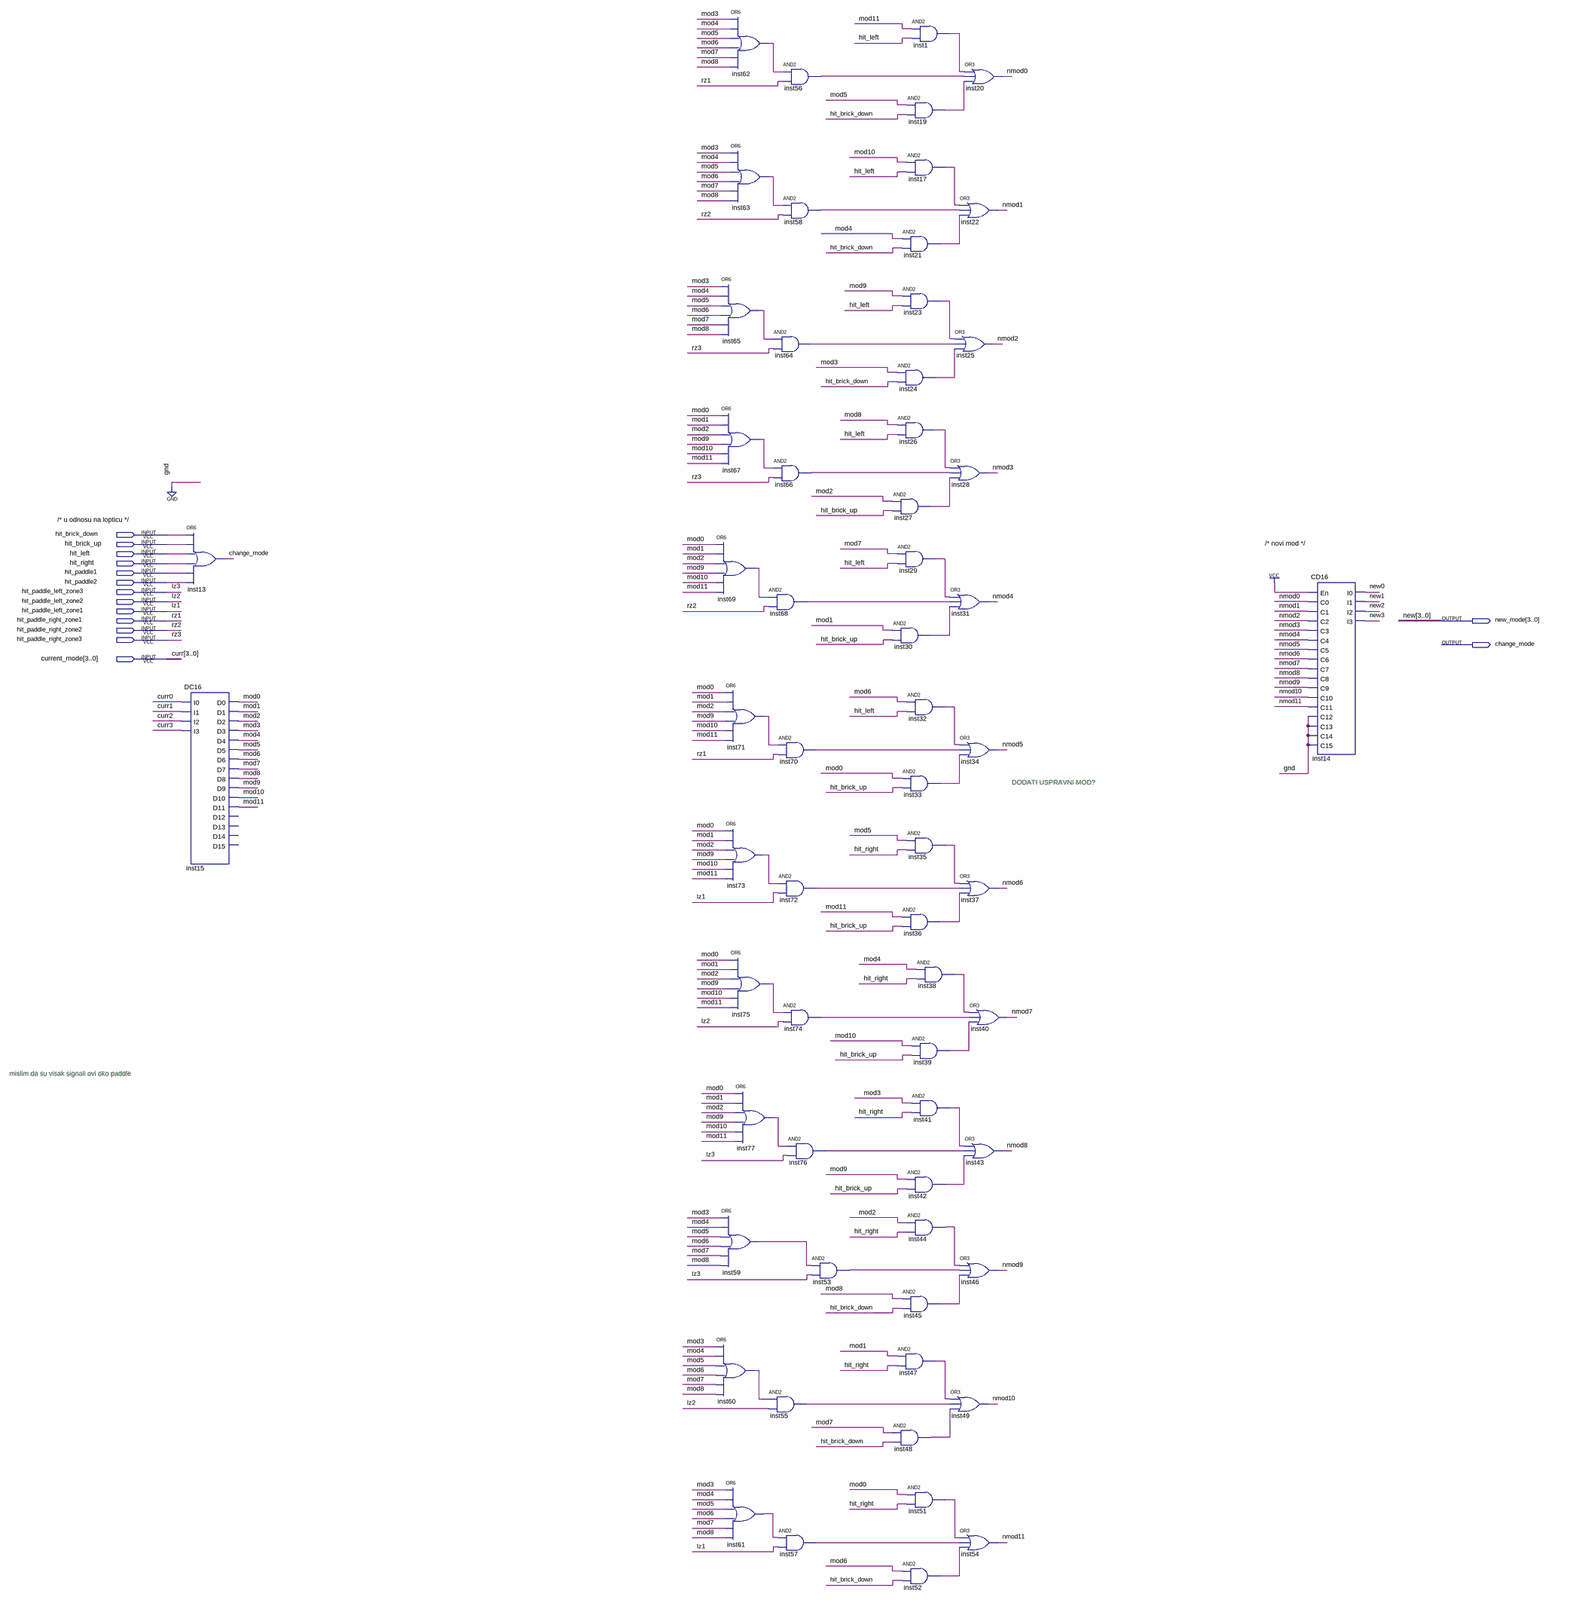
[diagram p0: schematic sheet, whole]
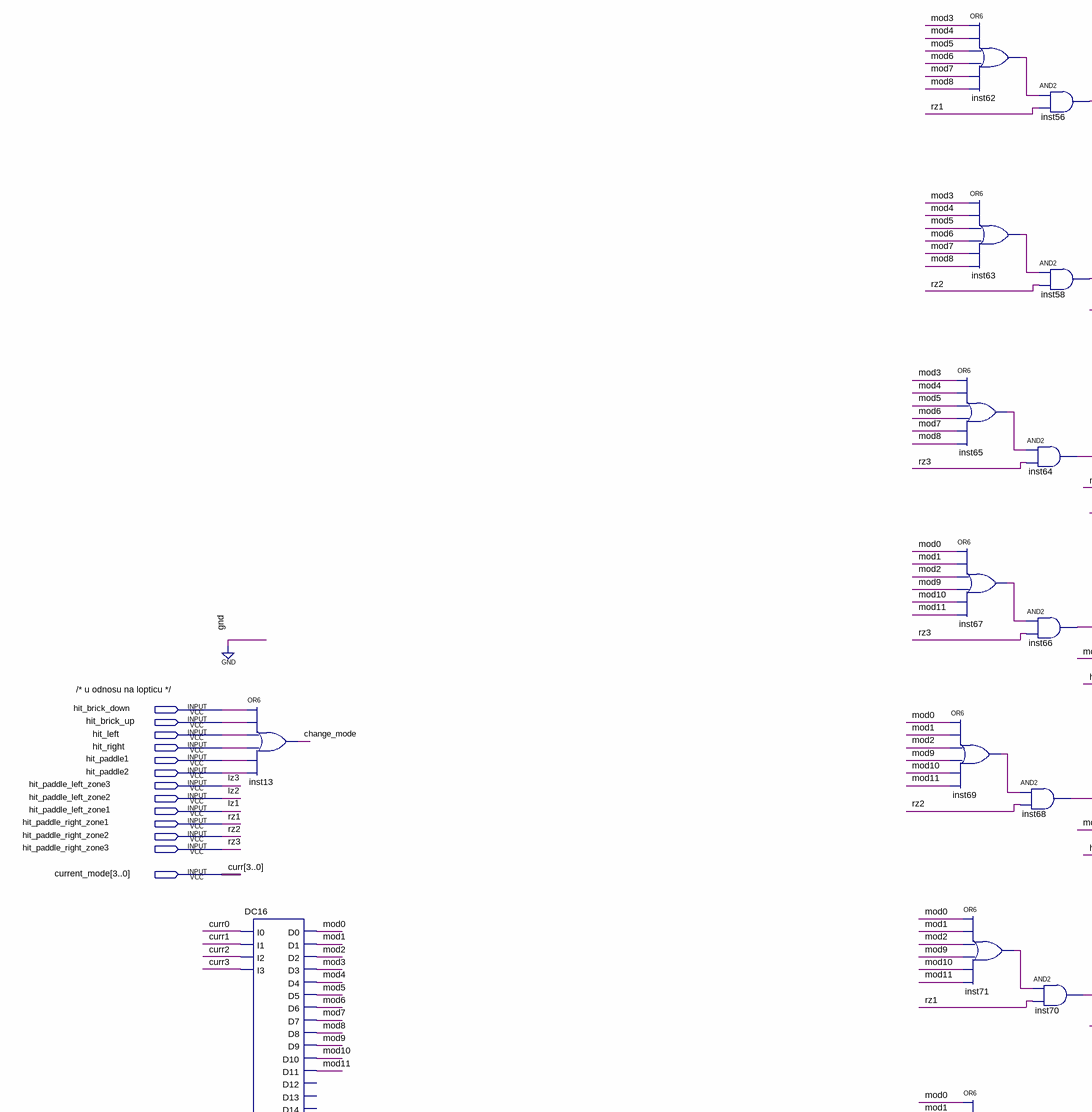
[diagram p1: schematic sheet, upper left part]
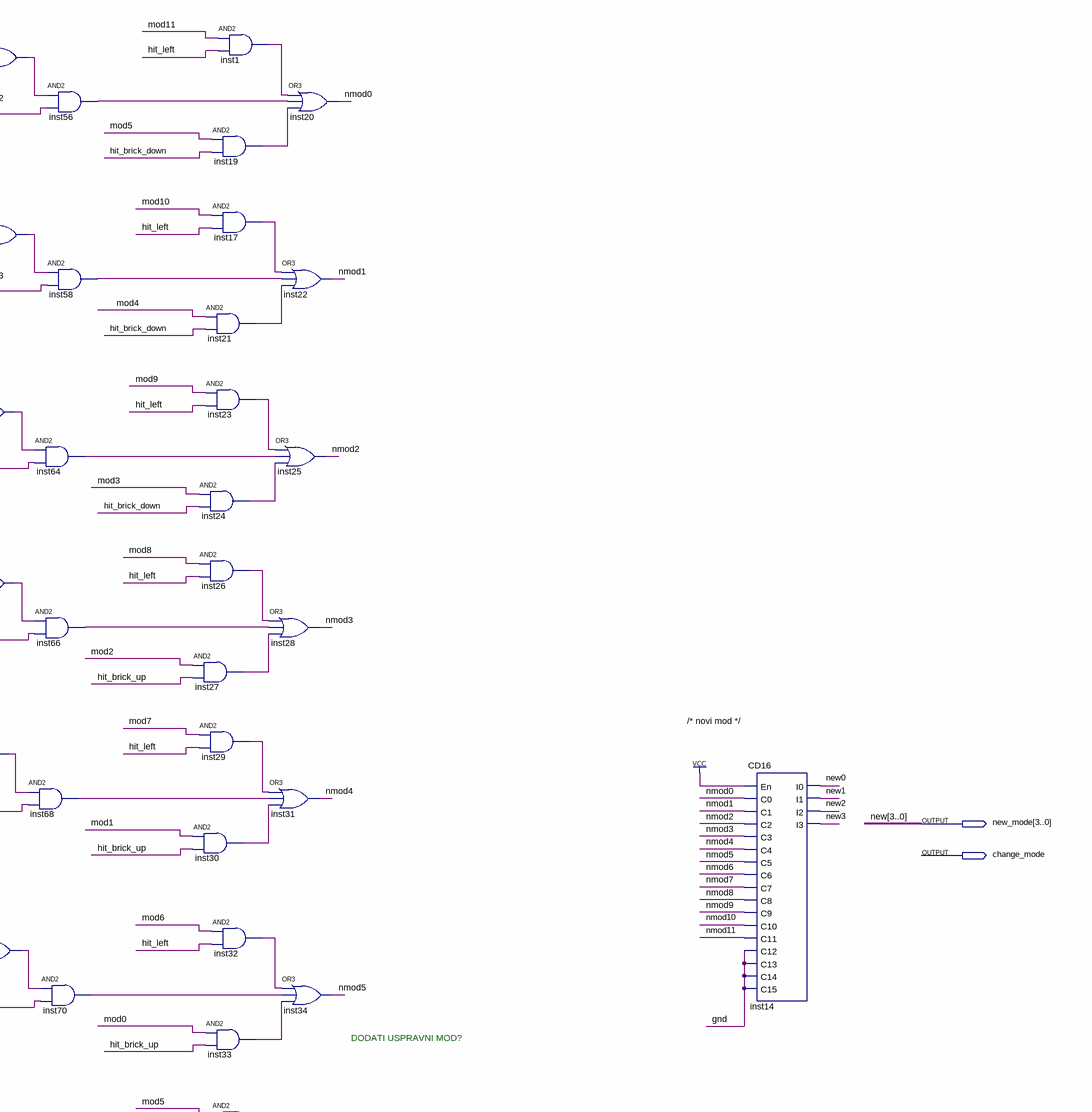
[diagram p2: schematic sheet, upper right part]
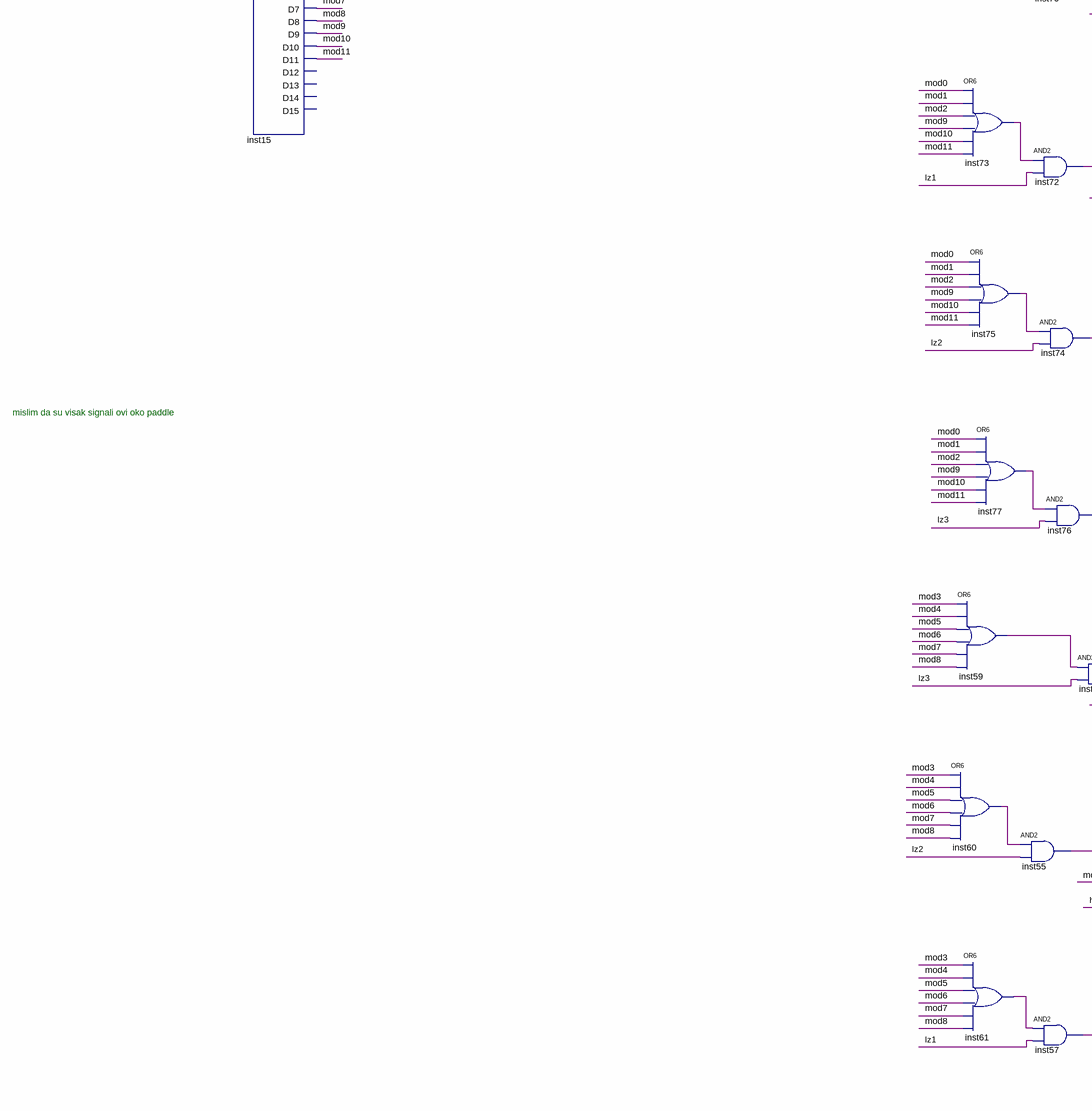
[diagram p3: schematic sheet, lower left part]
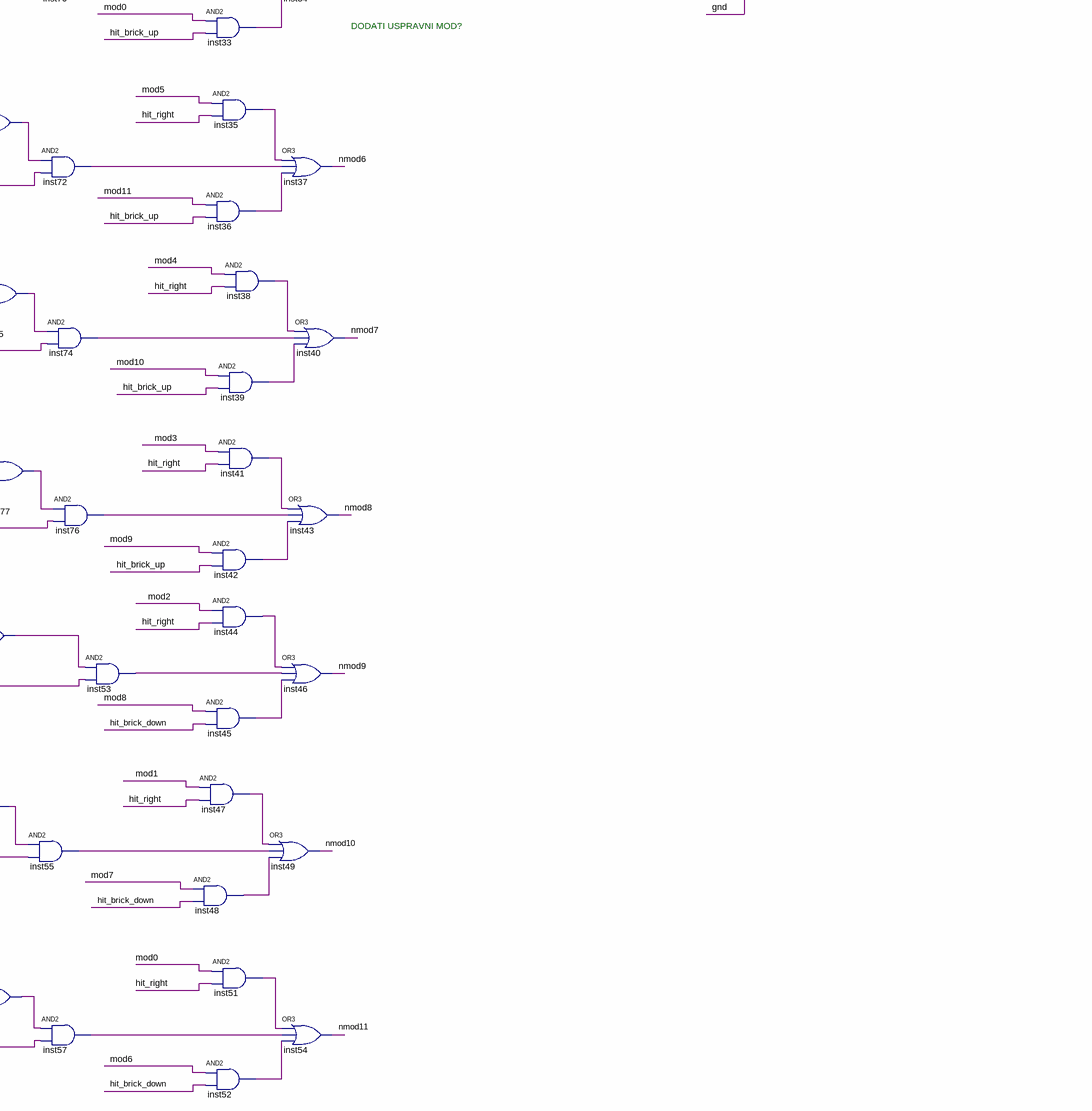
[diagram p4: schematic sheet, lower right part]
// Quartus schematic change_ball_movement.bdf as structural Verilog: 63 symbols, 15 pins
module change_ball_movement (
  input  hit_brick_down,
  input  hit_brick_up,
  input  hit_left,
  input  hit_right,
  input  hit_paddle1,
  input  hit_paddle2,
  input  hit_paddle_left_zone3,
  input  hit_paddle_left_zone2,
  input  hit_paddle_left_zone1,
  input  hit_paddle_right_zone1,
  input  hit_paddle_right_zone2,
  input  hit_paddle_right_zone3,
  input  [3:0] current_mode,
  output [3:0] new_mode,
  output change_mode
);

  wire inst1_out, inst17_out, inst19_out, inst21_out, inst23_out, inst24_out, inst26_out, inst27_out,
       inst29_out, inst30_out, inst32_out, inst33_out, inst35_out, inst36_out, inst38_out, inst39_out,
       inst41_out, inst42_out, inst44_out, inst45_out, inst47_out, inst48_out, inst51_out, inst52_out,
       inst53_out, inst55_out, inst56_out, inst57_out, inst58_out, inst59_out, inst60_out, inst61_out,
       inst62_out, inst63_out, inst64_out, inst65_out, inst66_out, inst67_out, inst68_out, inst69_out,
       inst70_out, inst71_out, inst72_out, inst73_out, inst74_out, inst75_out, inst76_out, inst77_out, mod0,
       mod1, mod2, mod3, mod4, mod5, mod6, mod7, mod8, mod9, mod10, mod11, nmod0, nmod1, nmod2, nmod3, nmod4,
       nmod5, nmod6, nmod7, nmod8, nmod9, nmod10, nmod11;

  or inst13 (change_mode, hit_brick_down, hit_brick_up, hit_left, hit_right, hit_paddle1, hit_paddle2);
  DC16 inst15 (
    .I0(current_mode[0]), .I1(current_mode[1]), .I2(current_mode[2]), .I3(current_mode[3]), .D0(mod0),
    .D1(mod1), .D2(mod2), .D3(mod3), .D4(mod4), .D5(mod5), .D6(mod6), .D7(mod7), .D8(mod8), .D9(mod9),
    .D10(mod10), .D11(mod11));  // open: D12, D13, D14, D15
  or inst62 (inst62_out, mod3, mod4, mod5, mod6, mod7, mod8);
  or inst63 (inst63_out, mod3, mod4, mod5, mod6, mod7, mod8);
  or inst65 (inst65_out, mod3, mod4, mod5, mod6, mod7, mod8);
  or inst67 (inst67_out, mod0, mod1, mod2, mod9, mod10, mod11);
  or inst69 (inst69_out, mod0, mod1, mod2, mod9, mod10, mod11);
  or inst71 (inst71_out, mod0, mod1, mod2, mod9, mod10, mod11);
  or inst73 (inst73_out, mod0, mod1, mod2, mod9, mod10, mod11);
  or inst75 (inst75_out, mod0, mod1, mod2, mod9, mod10, mod11);
  or inst77 (inst77_out, mod0, mod1, mod2, mod9, mod10, mod11);
  or inst59 (inst59_out, mod3, mod4, mod5, mod6, mod7, mod8);
  or inst60 (inst60_out, mod3, mod4, mod5, mod6, mod7, mod8);
  or inst61 (inst61_out, mod3, mod4, mod5, mod6, mod7, mod8);
  and inst64 (inst64_out, inst65_out, hit_paddle_right_zone3);
  and inst66 (inst66_out, inst67_out, hit_paddle_right_zone3);
  and inst68 (inst68_out, inst69_out, hit_paddle_right_zone2);
  and inst70 (inst70_out, inst71_out, hit_paddle_right_zone1);
  and inst72 (inst72_out, inst73_out, hit_paddle_left_zone1);
  and inst55 (inst55_out, inst60_out, hit_paddle_left_zone2);
  and inst57 (inst57_out, inst61_out, hit_paddle_left_zone1);
  and inst56 (inst56_out, inst62_out, hit_paddle_right_zone1);
  and inst58 (inst58_out, inst63_out, hit_paddle_right_zone2);
  and inst74 (inst74_out, inst75_out, hit_paddle_left_zone2);
  and inst76 (inst76_out, inst77_out, hit_paddle_left_zone3);
  and inst53 (inst53_out, inst59_out, hit_paddle_left_zone3);
  and inst27 (inst27_out, mod2, hit_brick_up);
  and inst30 (inst30_out, mod1, hit_brick_up);
  and inst48 (inst48_out, mod7, hit_brick_down);
  and inst1 (inst1_out, mod11, hit_left);
  and inst19 (inst19_out, mod5, hit_brick_down);
  and inst17 (inst17_out, mod10, hit_left);
  and inst21 (inst21_out, mod4, hit_brick_down);
  and inst23 (inst23_out, mod9, hit_left);
  and inst24 (inst24_out, mod3, hit_brick_down);
  and inst26 (inst26_out, mod8, hit_left);
  and inst29 (inst29_out, mod7, hit_left);
  and inst32 (inst32_out, mod6, hit_left);
  and inst33 (inst33_out, mod0, hit_brick_up);
  and inst35 (inst35_out, mod5, hit_right);
  and inst36 (inst36_out, mod11, hit_brick_up);
  and inst38 (inst38_out, mod4, hit_right);
  and inst39 (inst39_out, mod10, hit_brick_up);
  and inst41 (inst41_out, mod3, hit_right);
  and inst42 (inst42_out, mod9, hit_brick_up);
  and inst44 (inst44_out, mod2, hit_right);
  and inst45 (inst45_out, mod8, hit_brick_down);
  and inst47 (inst47_out, mod1, hit_right);
  and inst51 (inst51_out, mod0, hit_right);
  and inst52 (inst52_out, mod6, hit_brick_down);
  or inst20 (nmod0, inst1_out, inst56_out, inst19_out);
  or inst22 (nmod1, inst17_out, inst58_out, inst21_out);
  or inst25 (nmod2, inst23_out, inst64_out, inst24_out);
  or inst28 (nmod3, inst26_out, inst66_out, inst27_out);
  or inst31 (nmod4, inst29_out, inst68_out, inst30_out);
  or inst34 (nmod5, inst32_out, inst70_out, inst33_out);
  or inst37 (nmod6, inst35_out, inst72_out, inst36_out);
  or inst40 (nmod7, inst38_out, inst74_out, inst39_out);
  or inst43 (nmod8, inst41_out, inst76_out, inst42_out);
  or inst46 (nmod9, inst44_out, inst53_out, inst45_out);
  or inst49 (nmod10, inst47_out, inst55_out, inst48_out);
  or inst54 (nmod11, inst51_out, inst57_out, inst52_out);
  CD16 inst14 (
    .En(1'b1), .C0(nmod0), .C1(nmod1), .C2(nmod2), .C3(nmod3), .C4(nmod4), .C5(nmod5), .C6(nmod6),
    .C7(nmod7), .C8(nmod8), .C9(nmod9), .C10(nmod10), .C11(nmod11), .C12(1'b0), .C13(1'b0), .C14(1'b0),
    .C15(1'b0), .I0(new_mode[0]), .I1(new_mode[1]), .I2(new_mode[2]), .I3(new_mode[3]));

  // Other names for the same wires on the sheet: curr[3:0] = current_mode; curr0 = current_mode[0];
  //   curr1 = current_mode[1]; curr2 = current_mode[2]; curr3 = current_mode[3]; lz1 = hit_paddle_left_zone1;
  //   lz2 = hit_paddle_left_zone2; lz3 = hit_paddle_left_zone3; new[3:0] = new_mode; new0 = new_mode[0];
  //   new1 = new_mode[1]; new2 = new_mode[2]; new3 = new_mode[3]; rz1 = hit_paddle_right_zone1;
  //   rz2 = hit_paddle_right_zone2; rz3 = hit_paddle_right_zone3

  // Notes on the sheet:
  //   /* u odnosu na lopticu */
  //   /* novi mod */
  //   DODATI USPRAVNI MOD?
  //   mislim da su visak signali ovi oko paddle
endmodule
